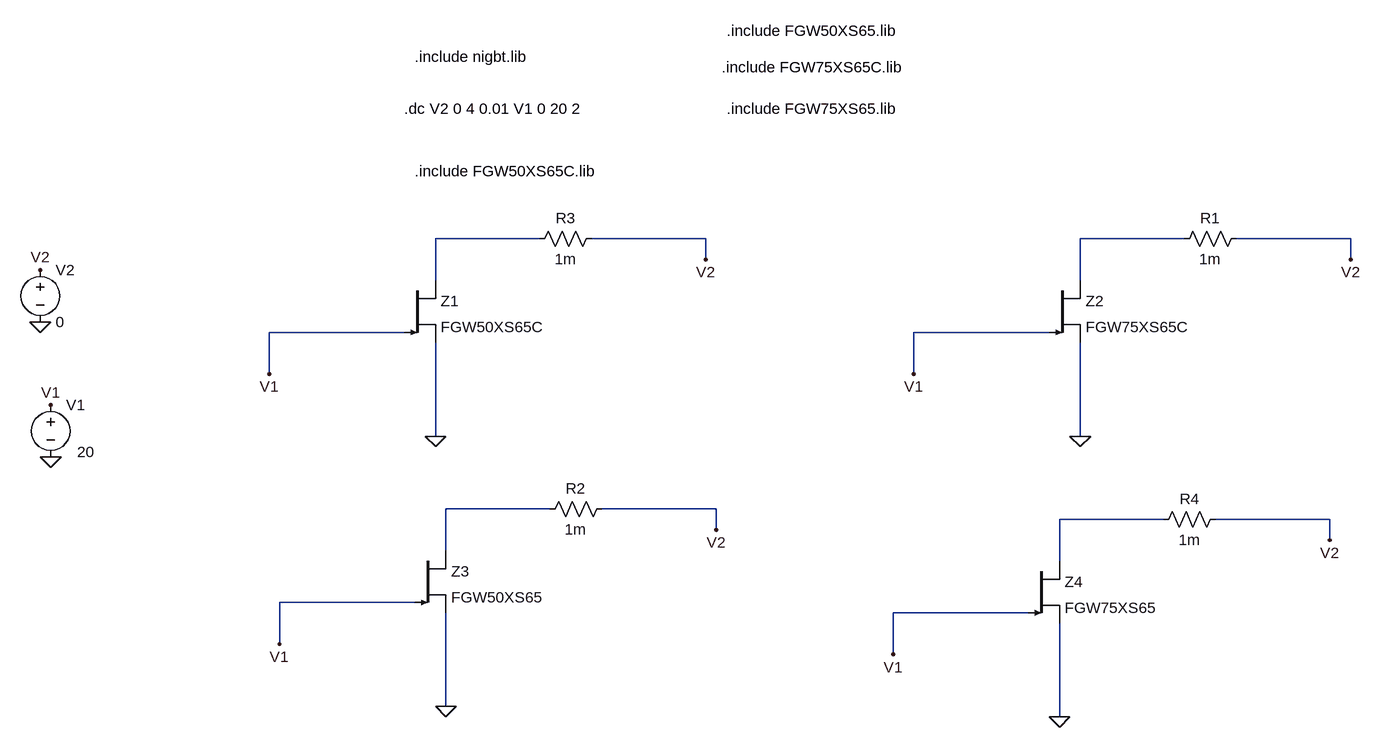
[diagram p0: schematic Ejercicio2.asc]
Ejercicio2.asc, the LTspice schematic file:
Version 4
SHEET 1 1448 680
WIRE 144 -176 -16 -176
WIRE 400 -176 224 -176
WIRE 1136 -176 976 -176
WIRE 1392 -176 1216 -176
WIRE 400 -144 400 -176
WIRE 1392 -144 1392 -176
WIRE -16 -112 -16 -176
WIRE 976 -112 976 -176
WIRE -64 -32 -272 -32
WIRE 928 -32 720 -32
WIRE -272 32 -272 -32
WIRE 720 32 720 -32
WIRE -16 128 -16 -16
WIRE 976 128 976 -16
WIRE 160 240 0 240
WIRE 416 240 240 240
WIRE 1104 256 944 256
WIRE 1360 256 1184 256
WIRE 416 272 416 240
WIRE 1360 288 1360 256
WIRE 0 304 0 240
WIRE 944 320 944 256
WIRE -48 384 -256 384
WIRE 896 400 688 400
WIRE -256 448 -256 384
WIRE 688 464 688 400
WIRE 0 544 0 400
WIRE 944 560 944 416
FLAG -16 128 0
FLAG -608 160 0
FLAG -624 -48 0
FLAG 976 128 0
FLAG 0 544 0
FLAG 944 560 0
FLAG 400 -144 V2
FLAG 1392 -144 V2
FLAG 1360 288 V2
FLAG 416 272 V2
FLAG -272 32 V1
FLAG -256 448 V1
FLAG 688 464 V1
FLAG 720 32 V1
FLAG -608 80 V1
FLAG -624 -128 V2
SYMBOL Misc\\NIGBT -64 -112 R0
SYMATTR InstName Z1
SYMATTR Value FGW50XS65C
SYMATTR Prefix X
SYMBOL voltage -608 64 R0
WINDOW 3 41 88 Left 2
SYMATTR Value 20
SYMATTR InstName V1
SYMBOL voltage -624 -144 R0
WINDOW 123 0 0 Left 0
WINDOW 39 0 0 Left 0
SYMATTR InstName V2
SYMATTR Value 0
SYMBOL res 240 -192 R90
WINDOW 0 0 56 VBottom 2
WINDOW 3 32 56 VTop 2
SYMATTR InstName R3
SYMATTR Value 1m
SYMBOL Misc\\NIGBT 928 -112 R0
SYMATTR InstName Z2
SYMATTR Value FGW75XS65C
SYMATTR Prefix X
SYMBOL res 1232 -192 R90
WINDOW 0 0 56 VBottom 2
WINDOW 3 32 56 VTop 2
SYMATTR InstName R1
SYMATTR Value 1m
SYMBOL Misc\\NIGBT -48 304 R0
SYMATTR InstName Z3
SYMATTR Value FGW50XS65
SYMATTR Prefix X
SYMBOL res 256 224 R90
WINDOW 0 0 56 VBottom 2
WINDOW 3 32 56 VTop 2
SYMATTR InstName R2
SYMATTR Value 1m
SYMBOL Misc\\NIGBT 896 320 R0
SYMATTR InstName Z4
SYMATTR Value FGW75XS65
SYMATTR Prefix X
SYMBOL res 1200 240 R90
WINDOW 0 0 56 VBottom 2
WINDOW 3 32 56 VTop 2
SYMATTR InstName R4
SYMATTR Value 1m
TEXT -48 -456 Left 2 !.include nigbt.lib
TEXT -64 -376 Left 2 !.dc V2 0 4 0.01 V1 0 20 2
TEXT -48 -280 Left 2 !.include FGW50XS65C.lib
TEXT 432 -496 Left 2 !.include FGW50XS65.lib
TEXT 424 -440 Left 2 !.include FGW75XS65C.lib
TEXT 432 -376 Left 2 !.include FGW75XS65.lib

The netlist it stands for:
* Ejercicio2.asc
XZ1 N001 V1 0 FGW50XS65C  ; pins C G E
V1 V1 0 20
V2 V2 0 0
R3 V2 N001 1m
XZ2 N002 V1 0 FGW75XS65C  ; pins C G E
R1 V2 N002 1m
XZ3 N003 V1 0 FGW50XS65  ; pins C G E
R2 V2 N003 1m
XZ4 N004 V1 0 FGW75XS65  ; pins C G E
R4 V2 N004 1m
.include nigbt.lib
.dc V2 0 4 0.01 V1 0 20 2
.include FGW50XS65C.lib
.include FGW50XS65.lib
.include FGW75XS65C.lib
.include FGW75XS65.lib
.backanno
.end